# Altium schematic sheet Gate_Drive.SchDoc
size A2; DrawnBy: Novikov M.I.
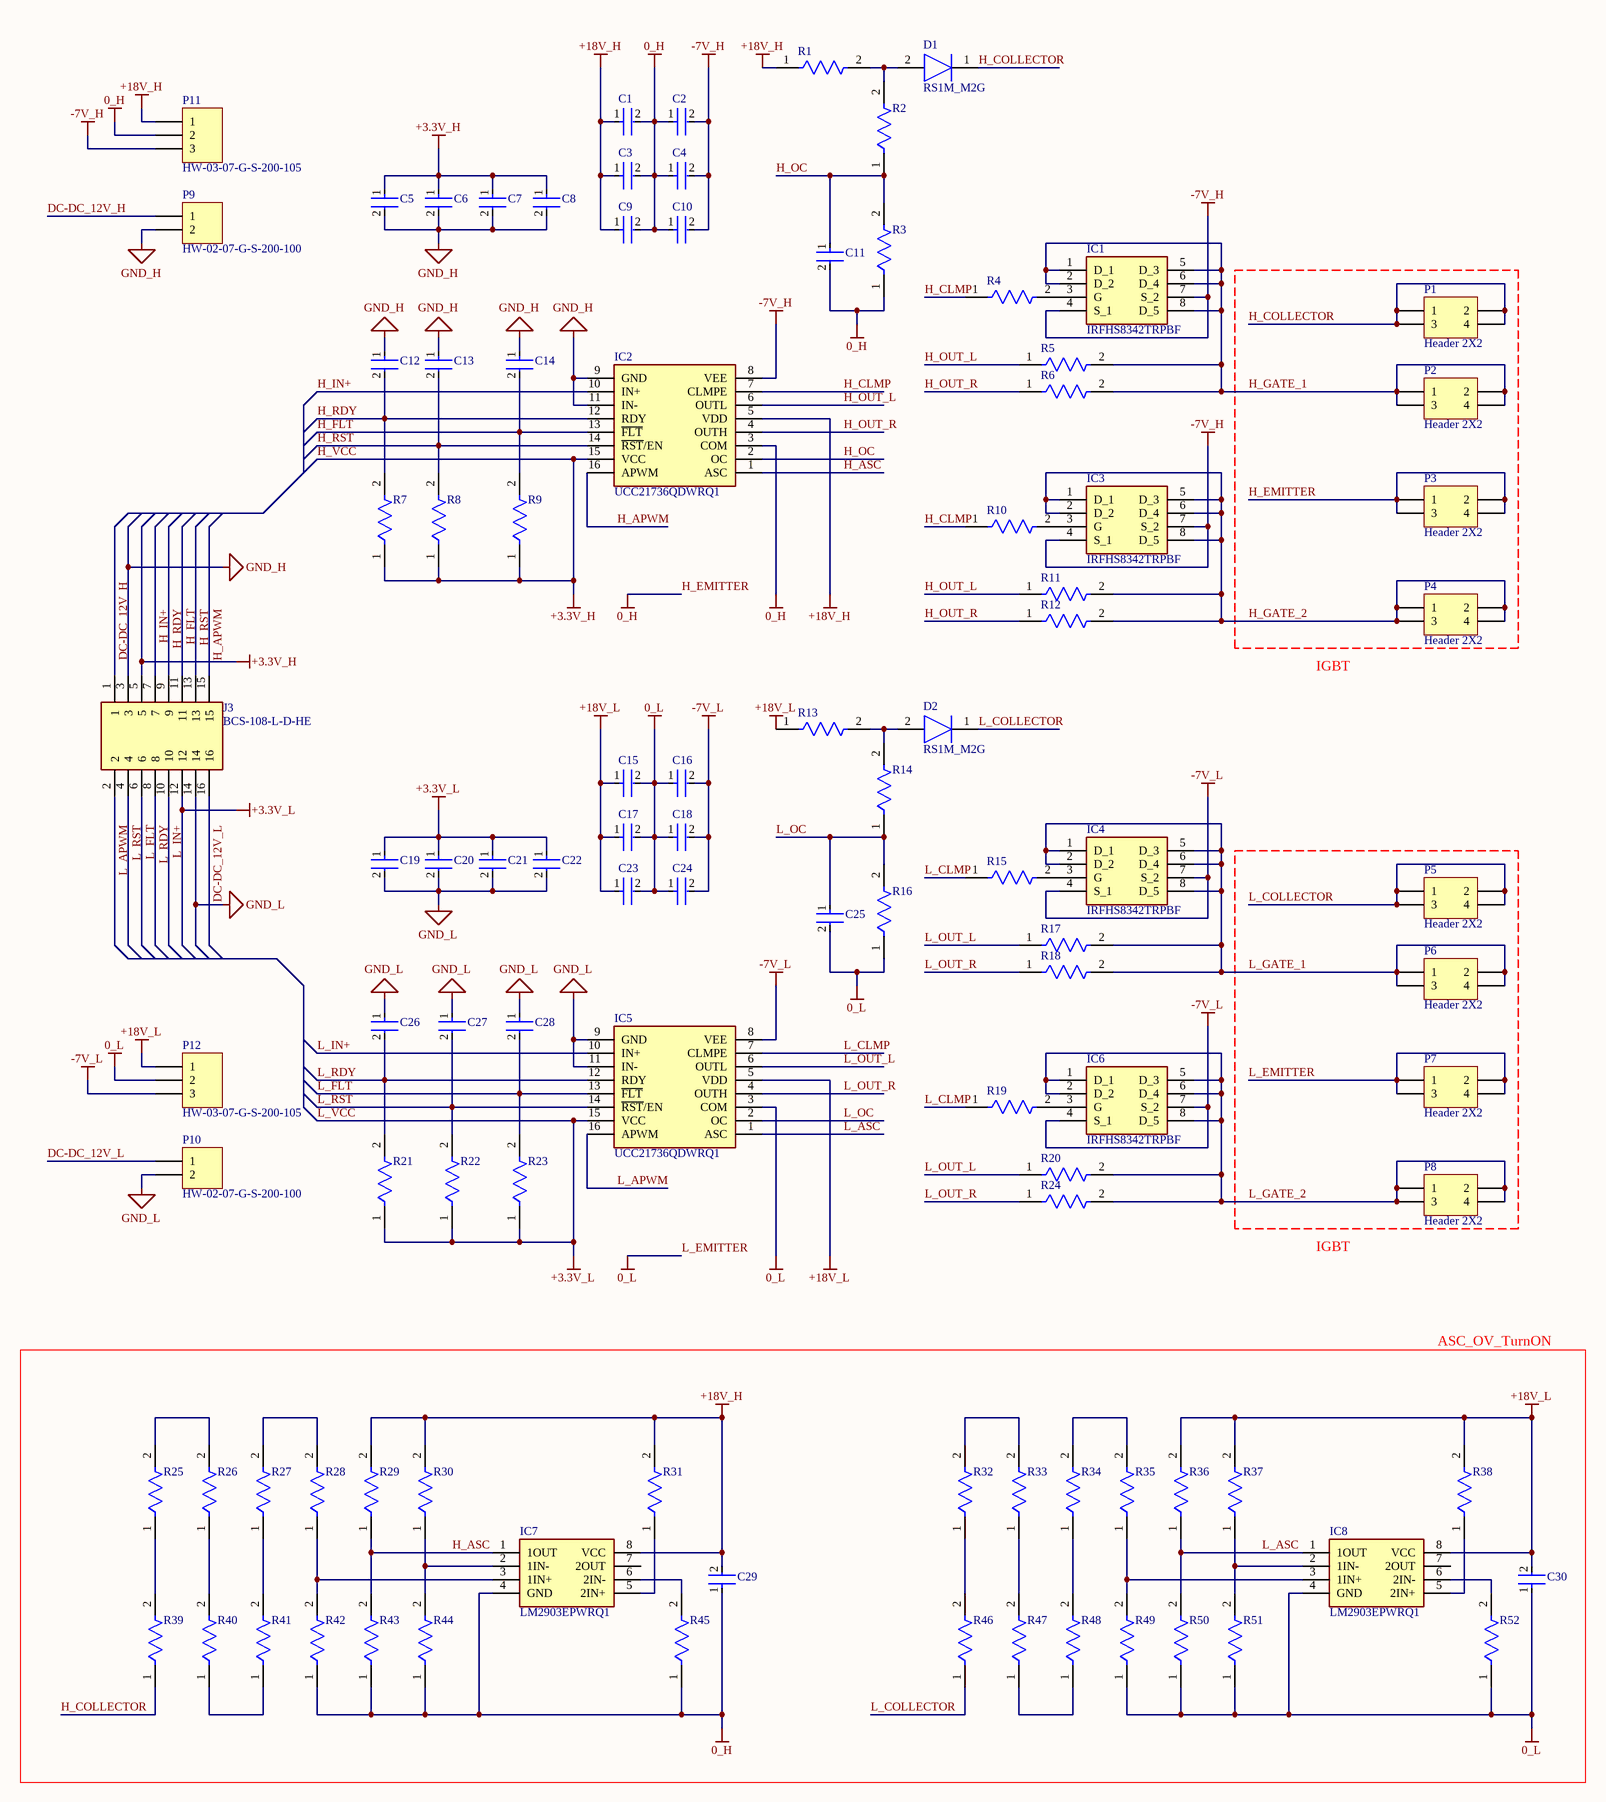
[diagram p0: Gate_Drive.SchDoc]

## Parts
C1  CGA5L2NP01H104J160AA  [FP-CGA5L-0_3-0_1-IPC_B]  (value not drawn)
C2  CGA5L2NP01H104J160AA  [FP-CGA5L-0_3-0_1-IPC_B]  (value not drawn)
C3  CGA6P1X8R1E106K250AC  [FP-CGA6P-IPC_B]  (value not drawn)
C4  CGA6P1X8R1E106K250AC  [FP-CGA6P-IPC_B]  (value not drawn)
C5  GCJ21BL81E105KA01L  [FP-GCJ21B-0_3-IPC_B]  (value not drawn)
C6  GCJ21BL81E105KA01L  [FP-GCJ21B-0_3-IPC_B]  (value not drawn)
C7  GCJ21BL81H104KA01L  [FP-GCJ21B-0_3-IPC_B]  (value not drawn)
C8  GCJ21BL81H104KA01L  [FP-GCJ21B-0_3-IPC_B]  (value not drawn)
C9  CGA6P1X8R1E106K250AC  [FP-CGA6P-IPC_B]  (value not drawn)
C10  CGA6P1X8R1E106K250AC  [FP-CGA6P-IPC_B]  (value not drawn)
C11  CGA4C4NP02W122J060AA  [FP-CGA4J-IPC_B]  (value not drawn)
C12  C0805C101J5HACAUTO  [FP-C0805C-DN-IPC_B]  (value not drawn)
C13  C0805C101J5HACAUTO  [FP-C0805C-DN-IPC_B]  (value not drawn)
C14  C0805C101J5HACAUTO  [FP-C0805C-DN-IPC_B]  (value not drawn)
C15  CGA5L2NP01H104J160AA  [FP-CGA5L-0_3-0_1-IPC_B]  (value not drawn)
C16  CGA5L2NP01H104J160AA  [FP-CGA5L-0_3-0_1-IPC_B]  (value not drawn)
C17  CGA6P1X8R1E106K250AC  [FP-CGA6P-IPC_B]  (value not drawn)
C18  CGA6P1X8R1E106K250AC  [FP-CGA6P-IPC_B]  (value not drawn)
C19  GCJ21BL81E105KA01L  [FP-GCJ21B-0_3-IPC_B]  (value not drawn)
C20  GCJ21BL81E105KA01L  [FP-GCJ21B-0_3-IPC_B]  (value not drawn)
C21  GCJ21BL81H104KA01L  [FP-GCJ21B-0_3-IPC_B]  (value not drawn)
C22  GCJ21BL81H104KA01L  [FP-GCJ21B-0_3-IPC_B]  (value not drawn)
C23  CGA6P1X8R1E106K250AC  [FP-CGA6P-IPC_B]  (value not drawn)
C24  CGA6P1X8R1E106K250AC  [FP-CGA6P-IPC_B]  (value not drawn)
C25  CGA4C4NP02W122J060AA  [FP-CGA4J-IPC_B]  (value not drawn)
C26  C0805C101J5HACAUTO  [FP-C0805C-DN-IPC_B]  (value not drawn)
C27  C0805C101J5HACAUTO  [FP-C0805C-DN-IPC_B]  (value not drawn)
C28  C0805C101J5HACAUTO  [FP-C0805C-DN-IPC_B]  (value not drawn)
C29  CGA5L2NP01H104J160AA  [FP-CGA5L-0_3-0_1-IPC_B]  (value not drawn)
C30  CGA5L2NP01H104J160AA  [FP-CGA5L-0_3-0_1-IPC_B]  (value not drawn)
D1  RS1M_M2G  [DIOM5126X250N]
D2  RS1M_M2G  [DIOM5126X250N]
IC1  IRFHS8342TRPBF  [PQFN(2X2)]
IC2  UCC21736QDWRQ1  [SOIC127P1030X265-16N]
IC3  IRFHS8342TRPBF  [PQFN(2X2)]
IC4  IRFHS8342TRPBF  [PQFN(2X2)]
IC5  UCC21736QDWRQ1  [SOIC127P1030X265-16N]
IC6  IRFHS8342TRPBF  [PQFN(2X2)]
IC7  LM2903EPWRQ1  [SOP65P640X120-8N]
IC8  LM2903EPWRQ1  [SOP65P640X120-8N]
J3  BCS-108-L-D-HE  [BCS-108-L-D-HE]
P1  Header 2X2  [HDR2X2]
P2  Header 2X2  [HDR2X2]
P3  Header 2X2  [HDR2X2]
P4  Header 2X2  [HDR2X2]
P5  Header 2X2  [HDR2X2]
P6  Header 2X2  [HDR2X2]
P7  Header 2X2  [HDR2X2]
P8  Header 2X2  [HDR2X2]
P9  HW-02-07-G-S-200-100  [PCBComponent_1]
P10  HW-02-07-G-S-200-100  [PCBComponent_1]
P11  HW-03-07-G-S-200-105  [PCBComponent_1]
P12  HW-03-07-G-S-200-105  [PCBComponent_1]
R1  CRCW08055K60FKEA  [FP-CRCW0805-e3-IPC_B]  (value not drawn)
R2  CRCW080510K0FKEA  [FP-CRCW0805-e3-IPC_B]  (value not drawn)
R3  CRCW08051K60JNEA  [FP-CRCW0805-e3-IPC_B]  (value not drawn)
R4  CRCW080522R0FKEA  [FP-CRCW0805-e3-IPC_C]  (value not drawn)
R5  CRCW25124R70JNEG  [FP-CRCW2512-e3-IPC_B]  (value not drawn)
R6  CRCW25124R30JNEG  [FP-CRCW2512-e3-IPC_B]  (value not drawn)
R7  CRCW08055K60FKEA  [FP-CRCW0805-e3-IPC_B]  (value not drawn)
R8  CRCW08055K60FKEA  [FP-CRCW0805-e3-IPC_B]  (value not drawn)
R9  CRCW08055K60FKEA  [FP-CRCW0805-e3-IPC_B]  (value not drawn)
R10  CRCW080522R0FKEA  [FP-CRCW0805-e3-IPC_C]  (value not drawn)
R11  CRCW25124R70JNEG  [FP-CRCW2512-e3-IPC_B]  (value not drawn)
R12  CRCW25124R30JNEG  [FP-CRCW2512-e3-IPC_B]  (value not drawn)
R13  CRCW08055K60FKEA  [FP-CRCW0805-e3-IPC_B]  (value not drawn)
R14  CRCW080510K0FKEA  [FP-CRCW0805-e3-IPC_B]  (value not drawn)
R15  CRCW080522R0FKEA  [FP-CRCW0805-e3-IPC_C]  (value not drawn)
R16  CRCW08051K60JNEA  [FP-CRCW0805-e3-IPC_B]  (value not drawn)
R17  CRCW25124R70JNEG  [FP-CRCW2512-e3-IPC_B]  (value not drawn)
R18  CRCW25124R30JNEG  [FP-CRCW2512-e3-IPC_B]  (value not drawn)
R19  CRCW080522R0FKEA  [FP-CRCW0805-e3-IPC_C]  (value not drawn)
R20  CRCW25124R70JNEG  [FP-CRCW2512-e3-IPC_B]  (value not drawn)
R21  CRCW08055K60FKEA  [FP-CRCW0805-e3-IPC_B]  (value not drawn)
R22  CRCW08055K60FKEA  [FP-CRCW0805-e3-IPC_B]  (value not drawn)
R23  CRCW08055K60FKEA  [FP-CRCW0805-e3-IPC_B]  (value not drawn)
R24  CRCW25124R30JNEG  [FP-CRCW2512-e3-IPC_B]  (value not drawn)
R25  RT0805BRD07200KL  [FP-RT0805-IPC_B]  (value not drawn)
R26  RT0805BRD07200KL  [FP-RT0805-IPC_B]  (value not drawn)
R27  RT0805BRD07200KL  [FP-RT0805-IPC_B]  (value not drawn)
R28  RT0805BRD07200KL  [FP-RT0805-IPC_B]  (value not drawn)
R29  CRCW080510K0FKEA  [FP-CRCW0805-e3-IPC_B]  (value not drawn)
R30  CRCW080510K0FKEA  [FP-CRCW0805-e3-IPC_B]  (value not drawn)
R31  CRCW080510K0FKEA  [FP-CRCW0805-e3-IPC_B]  (value not drawn)
R32  RT0805BRD07200KL  [FP-RT0805-IPC_B]  (value not drawn)
R33  RT0805BRD07200KL  [FP-RT0805-IPC_B]  (value not drawn)
R34  RT0805BRD07200KL  [FP-RT0805-IPC_B]  (value not drawn)
R35  RT0805BRD07200KL  [FP-RT0805-IPC_B]  (value not drawn)
R36  CRCW080510K0FKEA  [FP-CRCW0805-e3-IPC_B]  (value not drawn)
R37  CRCW080510K0FKEA  [FP-CRCW0805-e3-IPC_B]  (value not drawn)
R38  CRCW080510K0FKEA  [FP-CRCW0805-e3-IPC_B]  (value not drawn)
R39  RT0805BRD07200KL  [FP-RT0805-IPC_B]  (value not drawn)
R40  RT0805BRD07200KL  [FP-RT0805-IPC_B]  (value not drawn)
R41  RT0805BRD07200KL  [FP-RT0805-IPC_B]  (value not drawn)
R42  CRCW080510K0FKEA  [FP-CRCW0805-e3-IPC_B]  (value not drawn)
R43  CRCW08055K60FKEA  [FP-CRCW0805-e3-IPC_B]  (value not drawn)
R44  CRCW08055K60FKEA  [FP-CRCW0805-e3-IPC_B]  (value not drawn)
R45  CRCW080510K0FKEA  [FP-CRCW0805-e3-IPC_B]  (value not drawn)
R46  RT0805BRD07200KL  [FP-RT0805-IPC_B]  (value not drawn)
R47  RT0805BRD07200KL  [FP-RT0805-IPC_B]  (value not drawn)
R48  RT0805BRD07200KL  [FP-RT0805-IPC_B]  (value not drawn)
R49  CRCW080510K0FKEA  [FP-CRCW0805-e3-IPC_B]  (value not drawn)
R50  CRCW08055K60FKEA  [FP-CRCW0805-e3-IPC_B]  (value not drawn)
R51  CRCW08055K60FKEA  [FP-CRCW0805-e3-IPC_B]  (value not drawn)
R52  CRCW080510K0FKEA  [FP-CRCW0805-e3-IPC_B]  (value not drawn)

## Blocks framed on the sheet
ASC_OV_TurnON: C29 C30 IC7 IC8 R25-R52

## Nets
+18V_H: C1.1 C3.1 C9.1 C29.2 IC2.5(VDD) IC7.8(VCC) P11.1 R1.1 R29.2 R30.2 R31.2
+18V_L: C15.1 C17.1 C23.1 C30.2 IC5.5(VDD) IC8.8(VCC) P12.1 R13.1 R36.2 R37.2 R38.2
-7V_H: C2.2 C4.2 C10.2 IC1.4(S_1) IC1.7(S_2) IC2.8(VEE) IC3.4(S_1) IC3.7(S_2) P11.3
-7V_L: C16.2 C18.2 C24.2 IC4.4(S_1) IC4.7(S_2) IC5.8(VEE) IC6.4(S_1) IC6.7(S_2) P12.3
GND_H: C5.2 C6.2 C7.2 C8.2 C12.1 C13.1 C14.1 IC2.9(GND) IC2.11(IN-) J3.3 P9.2
GND_L: C19.2 C20.2 C21.2 C22.2 C26.1 C27.1 C28.1 IC5.9(GND) IC5.11(IN-) J3.14 P10.2
H_EMITTER: C1.2 C2.1 C3.2 C4.1 C9.2 C10.1 C11.2 C29.1 IC2.3(COM) IC7.4(GND) P3.1 P3.2 P3.3 P3.4 P11.2 R3.1 R42.1 R43.1 R44.1 R45.1  [also labelled 0_H]
H_VCC: C5.1 C6.1 C7.1 C8.1 IC2.15(VCC) J3.5 R7.1 R8.1 R9.1  [also labelled +3.3V_H]
L_EMITTER: C15.2 C16.1 C17.2 C18.1 C23.2 C24.1 C25.2 C30.1 IC5.3(COM) IC8.4(GND) P7.1 P7.2 P7.3 P7.4 P12.2 R16.1 R49.1 R50.1 R51.1 R52.1  [also labelled 0_L]
L_VCC: C19.1 C20.1 C21.1 C22.1 IC5.15(VCC) J3.12 R21.1 R22.1 R23.1  [also labelled +3.3V_L]
DC-DC_12V_H: J3.1 P9.1
DC-DC_12V_L: J3.16 P10.1
H_APWM: IC2.16(APWM) J3.15
H_ASC: IC2.1(ASC) IC7.1(1OUT) R29.1 R43.2
H_CLMP: IC2.7(CLMPE) R4.1 R10.1
H_COLLECTOR: D1.1(K) P1.1 P1.2 P1.3 P1.4 R39.1
H_FLT: C14.2 IC2.13(~{FLT}) J3.11 R9.2
H_GATE_1: IC1.1(D_1) IC1.2(D_2) IC1.5(D_3) IC1.6(D_4) IC1.8(D_5) P2.1 P2.2 P2.3 P2.4 R5.2 R6.2
H_GATE_2: IC3.1(D_1) IC3.2(D_2) IC3.5(D_3) IC3.6(D_4) IC3.8(D_5) P4.1 P4.2 P4.3 P4.4 R11.2 R12.2
H_IN+: IC2.10(IN+) J3.7
H_OC: C11.1 IC2.2(OC) R2.1 R3.2
H_OUT_L: IC2.6(OUTL) R5.1 R11.1
H_OUT_R: IC2.4(OUTH) R6.1 R12.1
H_RDY: C12.2 IC2.12(RDY) J3.9 R7.2
H_RST: C13.2 IC2.14(~{RST}/EN) J3.13 R8.2
L_APWM: IC5.16(APWM) J3.2
L_ASC: IC5.1(ASC) IC8.1(1OUT) R36.1 R50.2
L_CLMP: IC5.7(CLMPE) R15.1 R19.1
L_COLLECTOR: D2.1(K) P5.1 P5.2 P5.3 P5.4 R46.1
L_FLT: C28.2 IC5.13(~{FLT}) J3.6 R23.2
L_GATE_1: IC4.1(D_1) IC4.2(D_2) IC4.5(D_3) IC4.6(D_4) IC4.8(D_5) P6.1 P6.2 P6.3 P6.4 R17.2 R18.2
L_GATE_2: IC6.1(D_1) IC6.2(D_2) IC6.5(D_3) IC6.6(D_4) IC6.8(D_5) P8.1 P8.2 P8.3 P8.4 R20.2 R24.2
L_IN+: IC5.10(IN+) J3.10
L_OC: C25.1 IC5.2(OC) R14.1 R16.2
L_OUT_L: IC5.6(OUTL) R17.1 R20.1
L_OUT_R: IC5.4(OUTH) R18.1 R24.1
L_RDY: C26.2 IC5.12(RDY) J3.8 R21.2
L_RST: C27.2 IC5.14(~{RST}/EN) J3.4 R22.2
NetD1_2: D1.2(A) R1.2 R2.2
NetD2_2: D2.2(A) R13.2 R14.2
NetIC1_3: IC1.3(G) R4.2
NetIC3_3: IC3.3(G) R10.2
NetIC4_3: IC4.3(G) R15.2
NetIC6_3: IC6.3(G) R19.2
NetIC7_2: IC7.2(1IN-) R30.1 R44.2
NetIC7_3: IC7.3(1IN+) R28.1 R42.2
NetIC7_5: IC7.5(2IN+) R31.1
NetIC7_6: IC7.6(2IN-) R45.2
NetIC8_2: IC8.2(1IN-) R37.1 R51.2
NetIC8_3: IC8.3(1IN+) R35.1 R49.2
NetIC8_5: IC8.5(2IN+) R38.1
NetIC8_6: IC8.6(2IN-) R52.2
NetR25_1: R25.1 R39.2
NetR25_2: R25.2 R26.2
NetR26_1: R26.1 R40.2
NetR27_1: R27.1 R41.2
NetR27_2: R27.2 R28.2
NetR32_1: R32.1 R46.2
NetR32_2: R32.2 R33.2
NetR33_1: R33.1 R47.2
NetR34_1: R34.1 R48.2
NetR34_2: R34.2 R35.2
NetR40_1: R40.1 R41.1
NetR47_1: R47.1 R48.1

Not connected (* = marked no-connect by the designer): IC7 7(2OUT); IC8 7(2OUT)

## Notes on the sheet
- IGBT

## Library data of the parts
C1 C2 C15 C16 C29 C30 = CMP-08246-000628-1: Cap Ceramic 100nF 50V NP0 5% Pad SMD 1206 +150°C Automotive T/R; Voltage Rating: 50V; Packaging: Tape and Reel; Features: High Temperature; Package Quantity: 2000; Case Code (Metric): 3216; Min Operating Temperature: -55°C; Case/Package: 1206; Tolerance: 5%; Width: 0.063inch; Ratings: AEC-Q200; Thickness: 0.071inch; Mount: Surface Mount; Length: 0.126inch; Capacitance: 100nF; Case Code (Imperial): 1206; Max Operating Temperature: 150°C
C3 C4 C9 C10 C17 C18 C23 C24 = CMP-08246-001494-1: Cap Ceramic 10uF 25V X8R 10% Pad SMD 1210 +150°C Automotive T/R; Packaging: Cut Tape; Features: High Temperature; Case Code (Imperial): 1210; Voltage Rating: 25V; Mount: Surface Mount; Ratings: AEC-Q200; Case/Package: 1210; Case Code (Metric): 3225; Max Operating Temperature: 150°C; Capacitance: 10uF; Tolerance: 10%; Min Operating Temperature: -55°C
C5 C6 C19 C20 = CMP-06035-029661-1: Multilayer Ceramic Capacitors MLCC - SMD/SMT 0805 1uF 10%, 25VDC,  X8L +15/-40%; Voltage Rating: 25V; Max Operating Temperature: 150°C; Case Code (Metric): 2012; Case/Package: 0805; Features: Soft Termination; Min Operating Temperature: -55°C; Capacitance: 1uF; Packaging: Tape and Reel; Case Code (Imperial): 0805; Ratings: AEC-Q200; Mount: Surface Mount; Tolerance: 10%
C7 C8 C21 C22 = CMP-06035-032475-1: Multilayer Ceramic Capacitors MLCC - SMD/SMT 0805 0.1uF 10%, 50VDC,  X8L +15/-40%; Capacitance: 100nF; Voltage Rating: 50V; Max Operating Temperature: 150°C; Packaging: Tape and Reel; Tolerance: 10%; Case Code (Imperial): 0805; Mount: Surface Mount; Case Code (Metric): 2012; Ratings: AEC-Q200; Case/Package: 0805; Features: Soft Termination; Min Operating Temperature: -55°C
C11 C25 = CMP-08246-000791-1: Cap Ceramic 1.2nF 450V NP0 5% Pad SMD 0805 +150°C Automotive T/R; Dielectric: C0G; Capacitance: 1.2nF; Lead Free: Lead Free; Case/Package: 0805; Weight: 0.000194oz; Features: High Temperature; Min Operating Temperature: -55°C; Tolerance: 5%; Termination: SMD/SMT; Packaging: Tape and Reel; Thickness: 0.03inch; Voltage Rating (DC): 450V; Voltage Rating: 450V; Width: 0.049inch; Height: 0.6mm; Case Code (Metric): 2012; Composition: Ceramic; Ratings: AEC-Q200; Package Quantity: 4000; Mount: Surface Mount; Case Code (Imperial): 0805; Max Operating Temperature: 150°C; Length: 0.079inch
C12-C14 C26-C28 = CMP-03020-020342-1: CAP CER 0805 100PF 50V ULTRA STA; Manufacturer: KEMET; Temperature Characteristic: X8R; Material: Ceramic; Temperature Coefficient: 30ppm/°C; Tolerance: 0.05; Temperature Range High: +125°C; RoHS: TRUE; Temperature: -55°C to +125°C; Device Class L3: Ceramic Capacitors; ComponentLink2URL: https://content.kemet.com/datasheets/KEM_C1003_C0G_SMD.pdf; Package: C0805C-DN; Lead Free: Yes; Automotive: No; Voltage Rating: 50 V; Capacitance: 100 pF; Device Class L2: Capacitors; Digikey Description: CAP CER 0805 100PF 50V ULTRA STA; Mouser Description: Cap Ceramic 100pF 50V X8R 5% Pad SMD 0805 150C Automotive T/R; Ipc Land Pattern Name: CAPC200125X78; Temperature Range Low: -55°C; Device Class L1: Passive Components; ComponentLink2Description: Datasheet; Octopart: https://octopart.com/c0805c101j5hacauto-kemet-87698063; Category: Cap; Value: 100 pF; Height: 0.88mm; Manufacturer Part Number: C0805C101J5HACAUTO
D1 D2 = RS1M_M2G: Diode; Manufacturer_Name: Taiwan Semiconductor; Manufacturer_Part_Number: RS1M M2G; Datasheet Link: http://www.mouser.com/datasheet/2/395/RS1A SERIES_K15-1113611.pdf; Height: 2.5mm; Mouser Part Number: 821-RS1MM2G; Mouser Price/Stock: https://www.mouser.com/Search/Refine.aspx?Keyword=821-RS1MM2G; Arrow Part Number: RS1M M2G; Arrow Price/Stock: https://www.arrow.com/en/products/rs1m-m2g/taiwan-semiconductor
IC1 IC3 IC4 IC6 = IRFHS8342TRPBF: Integrated Circuit; Manufacturer_Name: Infineon; Datasheet Link: https://componentsearchengine.com/Datasheets/1/IRFHS8342TRPBF.pdf; Manufacturer_Part_Number: IRFHS8342TRPBF; Mouser Part Number: 942-IRFHS8342TRPBF; Mouser Price/Stock: https://www.mouser.co.uk/ProductDetail/Infineon-IR/IRFHS8342TRPBF?qs=Z8%252BeY1k3TILJK9l3AOTdfA%3D%3D; Arrow Part Number: IRFHS8342TRPBF; Arrow Price/Stock: https://www.arrow.com/en/products/irfhs8342trpbf/infineon-technologies-ag
IC2 IC5 = UCC21736QDWRQ1: Integrated Circuit; Manufacturer_Name: Texas Instruments; Datasheet Link: https://www.ti.com/lit/ds/symlink/ucc21736-q1.pdf?ts=1610170637293&ref_url=https%253A%252F%252Feu.mouser.com%252F; Height: 2.65mm; Manufacturer_Part_Number: UCC21736QDWRQ1; Mouser Part Number: 595-UCC21736QDWRQ1; Mouser Price/Stock: https://www.mouser.co.uk/ProductDetail/Texas-Instruments/UCC21736QDWRQ1/?qs=xZ%2FP%252Ba9zWqazxpYJ%2Flne3g%3D%3D
IC7 IC8 = LM2903EPWRQ1: Integrated Circuit; Manufacturer_Name: Texas Instruments; Datasheet Link: http://www.ti.com/lit/gpn/LM2903-Q1; Height: 1.2mm; Manufacturer_Part_Number: LM2903EPWRQ1; Mouser Part Number: 595-LM2903EPWRQ1; Mouser Price/Stock: https://www.mouser.co.uk/ProductDetail/Texas-Instruments/LM2903EPWRQ1/?qs=gTYE2QTfZfSOOljfli3%2Fvg%3D%3D; Arrow Part Number: LM2903EPWRQ1; Arrow Price/Stock: https://www.arrow.com/en/products/lm2903epwrq1/texas-instruments
J3 = BCS-108-L-D-HE: Connector; Manufacturer_Name: SAMTEC; Datasheet Link: http://suddendocs.samtec.com/prints/bcs-1xx-xxx-x-xx-xxx-mkt.pdf; Manufacturer_Part_Number: BCS-108-L-D-HE; System: Connector
P1-P8 = Header 2X2: Header, 2-Pin, Dual row; System: Connector; LatestRevisionDate: 17-Jul-2002; LatestRevisionNote: Re-released for DXP Platform.; Publisher: Altium Limited
P9 P10 = Header 2: Header, 2-Pin; System: Connector; LatestRevisionDate: 17-Jul-2002; LatestRevisionNote: Re-released for DXP Platform.; Publisher: Altium Limited
P11 P12 = Header 3: Header, 3-Pin; System: Connector; LatestRevisionDate: 17-Jul-2002; LatestRevisionNote: Re-released for DXP Platform.; Publisher: Altium Limited
  P11: Parameter 1: *
R1 R7-R9 R13 R21-R23 R43 R44 R50 R51 = CMP-2001-04030-2: RES Thick Film, 5.6kΩ, 1%, 0.125W, 100ppm/°C, 0805; Resistance: 5.6kR; Voltage Rating: 150V; Max Power Dissipation: 125mW; Case Code (Imperial): 0805; Features: Automotive AEC-Q200; Composition: Thick Film; Package Quantity: 1; Mount: Surface Mount; Tolerance: 1%; Radiation Hardening: No; Length: 2mm; Case Code (Metric): 2012; Temperature Coefficient: 100ppm/°C; Power Rating: 125mW; Number of Terminations: 2; Lead Free: Lead Free; Voltage Rating (DC): 150V; Military Standard: Not; Number of Pins: 2; Height: 0.45mm; Depth: 1.25mm; Weight: 0.000194oz; Packaging: Tape and Reel; Case/Package: 0805; Contact Plating: Tin; Min Operating Temperature: -55°C; Termination: SMD/SMT; Max Operating Temperature: 155°C; Width: 1.25mm
R2 R14 R29-R31 R36-R38 R42 R45 R49 R52 = CMP-2001-04908-2: RES Thick Film, 10kΩ, 1%, 0.125W, 100ppm/°C, 0805; Resistance: 10kR; Voltage Rating (DC): 150V; Power Rating: 125mW; Weight: 0.000194oz; Package Quantity: 5000; Military Standard: Not; Max Operating Temperature: 155°C; Temperature Coefficient: 100ppm/°C; Contact Plating: Tin; Width: 1.25mm; Height: 0.45mm; Radiation Hardening: No; Tolerance: 1%; Min Operating Temperature: -55°C; Voltage Rating: 150V; Length: 2mm; Depth: 1.25mm; Termination: SMD/SMT; Packaging: Tape and Reel; Case/Package: 0805; Case Code (Metric): 2012; Lead Free: Lead Free; Case Code (Imperial): 0805; Composition: Thick Film
R3 R16 = CMP-1013-00079-3: RES Thick Film, 1.6kΩ, 5%, 0.125W, 200ppm/°C, 0805; Max Power Dissipation: 125mW; Resistance: 1.6kR; Voltage Rating (DC): 150V; Case Code (Metric): 2012; Max Operating Temperature: 155°C; Min Operating Temperature: -55°C; Packaging: Tape and Reel; Width: 0.049inch; Package Quantity: 1; Temperature Coefficient: 200ppm/°C; Lead Free: Lead Free; Case Code (Imperial): 0805; Contact Plating: Tin; Tolerance: 5%; Radiation Hardening: No; Depth: 1.25mm; Power Rating: 125mW; Case/Package: 0805; Voltage Rating: 150V; Length: 2mm; Features: Automotive AEC-Q200; Composition: Thick Film; Weight: 0.000194oz; Number of Terminations: 2; Height: 0.02inch; Military Standard: Not
R4 R10 R15 R19 = CMP-2001-03692-2: RES Thick Film, 22Ω, 1%, 0.125W, 100ppm/°C, 0805; Resistance: 22R; Power Rating: 125mW; Voltage Rating: 150V; Case/Package: 0805; Radiation Hardening: No; Number of Terminations: 2; Termination: SMD/SMT; Package Quantity: 5000; Weight: 0.000194oz; Mount: Surface Mount; Lead Free: Lead Free; Height: 0.45mm; Composition: Thick Film; Min Operating Temperature: -55°C; Case Code (Metric): 2012; Temperature Coefficient: 100ppm/°C; Depth: 1.25mm; Packaging: Tape and Reel; Contact Plating: Tin; Width: 1.25mm; Case Code (Imperial): 0805; Length: 2mm; Max Operating Temperature: 155°C; Tolerance: 1%; Features: Automotive AEC-Q200; Military Standard: Not; Voltage Rating (DC): 150V; Max Power Dissipation: 125mW
R5 R11 R17 R20 = CMP-1018-00018-2: RES Thick Film, 4.7Ω, 5%, 1W, 200ppm/°C, 2512; Voltage Rating: 500V; Resistance: 4.7R; Composition: Thick Film; Temperature Coefficient: 200ppm/°C; Number of Terminations: 2; Contact Plating: Tin; Lead Free: Lead Free; Length: 6.3mm; Termination: SMD/SMT; Weight: 0.001429oz; Width: 3.15mm; Features: Automotive AEC-Q200; Case/Package: 2512; Power Rating: 1W; Min Operating Temperature: -55°C; Radiation Hardening: No; Depth: 3.15mm; Case Code (Metric): 6432; Number of Pins: 2; Mount: Surface Mount; Tolerance: 5%; Military Standard: Not; Height: 0.6mm; Max Power Dissipation: 1W; Max Operating Temperature: 155°C; Voltage Rating (DC): 500V; Package Quantity: 2000; Packaging: Tape and Reel; Case Code (Imperial): 2512
R6 R12 R18 R24 = CMP-1018-00017-2: RES Thick Film, 4.3Ω, 5%, 1W, 200ppm/°C, 2512; Resistance: 4.3R; Voltage Rating: 500V; Min Operating Temperature: -55°C; Max Power Dissipation: 1W; Number of Terminations: 2; Contact Plating: Tin; Termination: SMD/SMT; Package Quantity: 2000; Tolerance: 5%; Max Operating Temperature: 155°C; Lead Free: Lead Free; Weight: 0.001429oz; Composition: Thick Film; Temperature Coefficient: 200ppm/°C; Case Code (Imperial): 2512; Length: 6.3mm; Number of Pins: 2; Power Rating: 1W; Width: 0.124inch; Radiation Hardening: No; Case/Package: 2512; Features: Automotive AEC-Q200; Height: 0.028inch; Military Standard: Not; Depth: 3.15mm; Case Code (Metric): 6432; Packaging: Tape and Reel; Voltage Rating (DC): 500V
R25-R28 R32-R35 R39-R41 R46-R48 = CMP-2001-01722-2: RES SMD 200K OHM 0.1% 1/8W 0805; Manufacturer: Yageo; Voltage Rating: 150V; Resistance: 200KΩ; Power Rating: 0.125W; Value: 200KΩ; Tolerance: 0.0025; Temperature Coefficient: 25 ppm/°C; Automotive: No; Manufacturer Part Number: RT0805BRD07200KL; Package: RT0805; RoHS: TRUE; Ipc Land Pattern Name: RESC200125X50; Series: RT; Height: 0.6mm; Device Class L1: Passive Components; Footprint Url: http://www.yageo.com/exep/pages/download/literatures/PYu-R_Mount_10.pdf; Mouser Description: High Precision-High Stability Chip Resistor Thin Film 0805 200kOhm 0.1% Paper T/R; Composition: Thin Film; Temperature: -55°C to +155°C; Device Class L3: Chip SMD Resistors; Temperature Range Low: -55°C; Octopart: https://octopart.com/rt0805brd07200kl-yageo-1477199; Device Class L2: Resistors; Temperature Range High: +155°C; ComponentLink2Description: Datasheet; Category: Res; Lead Free: Yes; ComponentLink2URL: http://www.yageo.com/documents/recent/PYu-RT_1-to-0.01_RoHS_L_9.pdf; Digikey Description: RES SMD 200K OHM 0.1% 1/8W 0805